# Altium project ESP_Grow_Main_V2.PrjPCB (part 2 of 2)

## Sheet ESP_Grow_Main_V2_4_3V_5V.SchDoc: Power Rails
size A; Date: 5/4/2019; Author: Kyle R; Revision: A; SheetNumber: 4; SheetTotal: 5
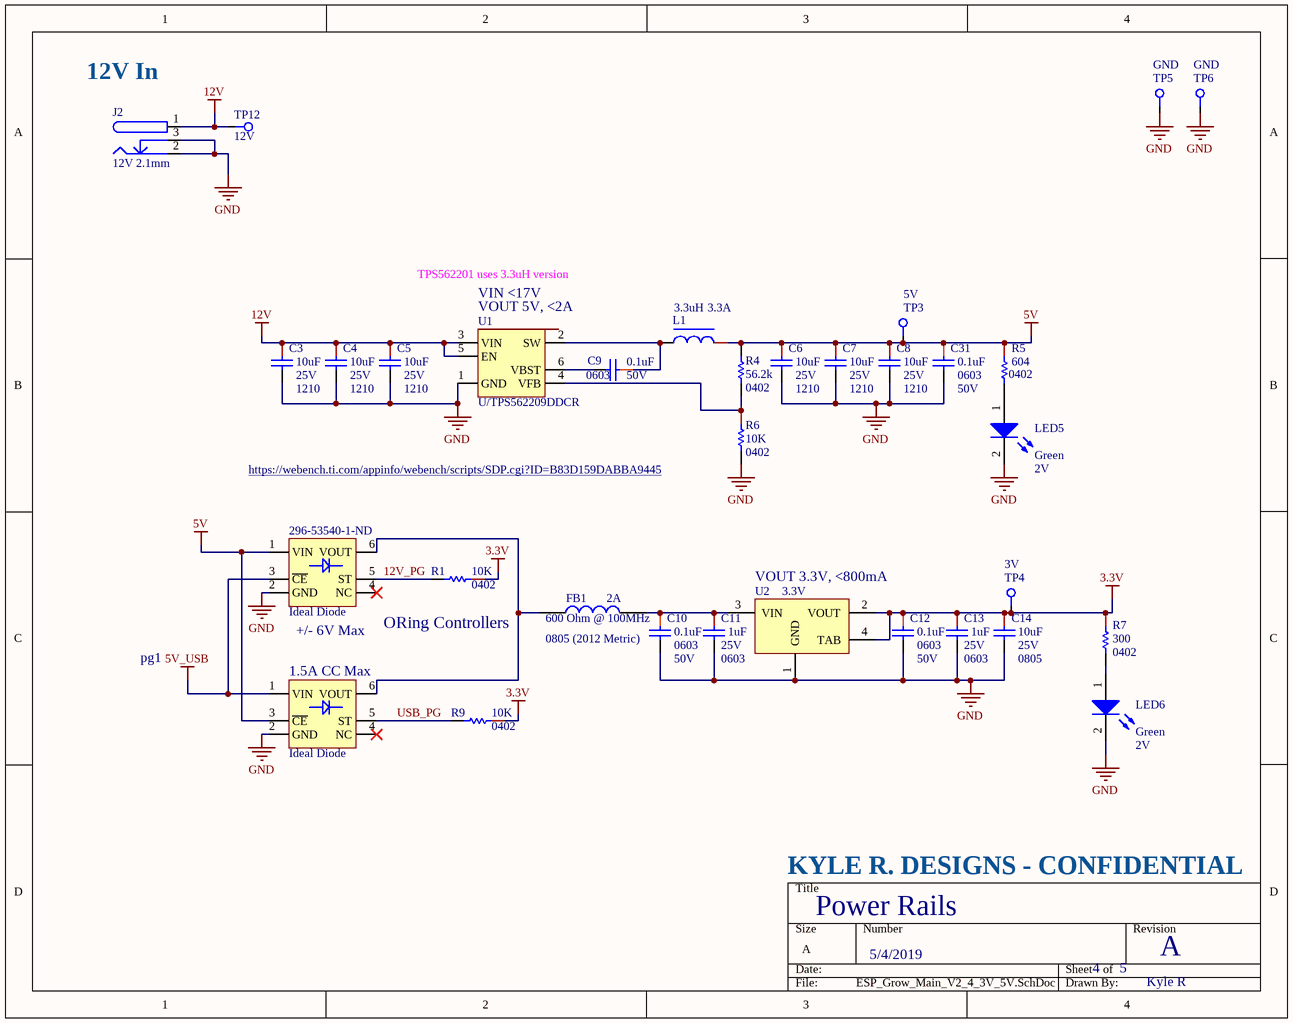
[diagram p4: ESP_Grow_Main_V2_4_3V_5V.SchDoc]

### Parts
C3  10uF  Package / Case: 1210  Voltage Rated: 25V  [CAPC1210(3225)_N]
C4  10uF  Package / Case: 1210  Voltage Rated: 25V  [CAPC1210(3225)_N]
C5  10uF  Package / Case: 1210  Voltage Rated: 25V  [CAPC1210(3225)_N]
C6  10uF  Package / Case: 1210  Voltage Rated: 25V  [CAPC1210(3225)_N]
C7  10uF  Package / Case: 1210  Voltage Rated: 25V  [CAPC1210(3225)_N]
C8  10uF  Package / Case: 1210  Voltage Rated: 25V  [CAPC1210(3225)_N]
C9  Package / Case: 0603  Voltage - Rated: 50V  [CAPC0603(1608)_L]  (hidden comment: 0.1uF)
C10  Package / Case: 0603  Voltage - Rated: 50V  [CAPC0603(1608)_L]  (hidden comment: 0.1uF)
C11  1uF  Voltage - Rated: 25V  Package / Case: 0603  [CAPC0603(1608)_N]
C12  Package / Case: 0603  Voltage - Rated: 50V  [CAPC0603(1608)_L]  (hidden comment: 0.1uF)
C13  1uF  Voltage - Rated: 25V  Package / Case: 0603  [CAPC0603(1608)_N]
C14  10uF  Voltage - Rated: 25V  Package / Case: 0805  [CAPC0805(2012)_L]
C31  Package / Case: 0603  Voltage - Rated: 50V  [CAPC0603(1608)_L]  (hidden comment: 0.1uF)
FB1  600 Ohm @ 100MHz  Current Rating: 2A  Package / Case: 0805 (2012 Metric)  [RESC0805(2012)_N]
J2  12V 2.1mm  [CONN_PWR_JACK_2.1x5.5mm]
L1  Max Current: 3.3A  [MWSA0402S-3R3MT]  (hidden comment: 3.3uH ±20% 3.3A 87mΩ)
LED5  Color: Green  Voltage - Forward (Vf) (Typ): 2V  [SM-LED-0603]  (hidden comment: 5V)
LED6  Color: Green  Voltage - Forward (Vf) (Typ): 2V  [SM-LED-0603]  (hidden comment: 3.3V)
R1  Resistance: 10K  Package: 0402  [RESC0402(1005)_N]  (hidden comment: 0402WGF1002TCE)
R4  Resistance (Ohms): 56.2k  Package / Case: 0402  [RESC0402(1005)_N]  (hidden comment: 56.2K 1%)
R5  Package (Imperial): 0402  [RESC0402(1005)_M]  (hidden comment: 604)
R6  Resistance: 10K  Package: 0402  [RESC0402(1005)_N]  (hidden comment: 0402WGF1002TCE)
R7  Package (Imperial): 0402  Resistance: 300  [RESC0402(1005)_L]  (hidden comment: RES SMD 300 OHM 1% 1/10W 0402)
R9  Resistance: 10K  Package: 0402  [RESC0402(1005)_N]  (hidden comment: 0402WGF1002TCE)
TP3  5V  [Pogo-Testpoint]  (no BOM)
TP4  3V  [Pogo-Testpoint]  (no BOM)
TP5  GND  [Pogo-Testpoint]  (no BOM)
TP6  GND  [Pogo-Testpoint]  (no BOM)
TP12  12V  [Pogo-Testpoint]  (no BOM)
U1  U/TPS562209DDCR  [SOT-23]
U2  3.3V  [DSO-G3]
U14  Ideal Diode  Supplier Part Number 1: 296-53540-1-ND  [SC-70-6]
U15  Ideal Diode  [SC-70-6]

### Nets
3.3V: C12.1 C13.1 C14.1 R1.1 R7.1 R9.1 TP4.1 U2.2(VOUT) U2.4(TAB)
5V: C6.1 C7.1 C8.1 C31.1 L1.1 R4.2 R5.1 TP3.1 U14.1(VIN) U15.3(~{CE})
5V_USB: U14.3(~{CE}) U15.1(VIN)
12V: C3.1 C4.1 C5.1 J2.1 TP12.1 U1.3(VIN) U1.5(EN)
GND: C3.2 C4.2 C5.2 C6.2 C7.2 C8.2 C10.2 C11.2 C12.2 C13.2 C14.2 C31.2 J2.2 J2.3 LED5.2(K) LED6.2(K) R6.2 TP5.1 TP6.1 U1.1(GND) U2.1(GND) U14.2(GND) U15.2(GND)
12V_PG: R1.2 U14.5(ST)
USB_PG: R9.2 U15.5(ST)
NetC9_1: C9.1 L1.2 U1.2(SW)
NetC9_2: C9.2 U1.6(VBST)
NetC10_1: C10.1 C11.1 FB1.2 U2.3(VIN)
NetFB1_1: FB1.1 U14.6(VOUT) U15.6(VOUT)
NetLED5_1: LED5.1(A) R5.2
NetLED6_1: LED6.1(A) R7.2
NetR4_1: R4.1 R6.1 U1.4(VFB)

Not connected (* = marked no-connect by the designer): U14 4(NC)*; U15 4(NC)*

### Notes on the sheet
- (near J2) 12V In
- TPS562201 uses 3.3uH version
- (near U1) VIN <17V
- (near U1) VOUT 5V, <2A
- (near R6) https://webench.ti.com/appinfo/webench/scripts/SDP.cgi?ID=B83D159DABBA9445
- (near U14) +/- 6V Max
- ORing Controllers
- (near U2) VOUT 3.3V, <800mA
- pg1
- (near U15) 1.5A CC Max
- KYLE R. DESIGNS - CONFIDENTIAL

### Library data of the parts
C3-C8 = CAP CER 10UF 25V JB 1210: 10uF 1210 25V; Manufacturer: TDK Corporation; Manufacturer Part Number: C3225JB1E106K250AA; Tolerance: ±10%; Temperature Coefficient: JB; Notification: Current market demand for these product types have resulted in fluctuating and extending lead times. Lead times may differ.; Supplier 1: Digi-Key; RoHS: RoHS Compliant; Category: Capacitors; Stock 1: 19014; Pricing 1: 1=0.74, 10=0.525, 100=0.3454, 500=0.25588 (USD); Packaging: Cut Tape (CT); Part Status: Active; Operating Temperature: -25°C ~ 85°C; Ratings: -; Applications: General Purpose; Failure Rate: -; Mounting Type: Surface Mount, MLCC; Size / Dimension: 0.126" L x 0.098" W (3.20mm x 2.50mm); Height - Seated (Max): -; Thickness (Max): 0.110" (2.80mm); Lead Spacing: -; Lead Style: -; ComponentLink1URL: https://product.tdk.com/info/en/catalog/datasheets/mlcc_commercial_general_en.pdf; ComponentLink1Description: https://product.tdk.com/info/en/catalog/datasheets/mlcc_commercial_general_en.pdf; Supplier Part Number 1: 445-11850-1-ND; Voltage - Rated: 25V; Features: Low ESL
C9 C10 C12 C31 = 0.1uF_0603: 100NF 50V 0603; Manufacturer: YAGEO; Manufacturer Part Number: CC0603KRX7R9BB104; Tolerance: ±10%; Temperature Coefficient: X7R; Supplier 1: Digi-Key; RoHS: RoHS Compliant; Category: Capacitors; Stock 1: 2360000; Pricing 1: 4000=0.00414, 8000=0.00378, 12000=0.0036, 28000=0.00342, 100000=0.00248 (USD); Packaging: Tape & Reel (TR); Mounting Type: Surface Mount, MLCC; Operating Temperature: -55°C ~ 125°C; Applications: General Purpose; Ratings: -; Size / Dimension: 0.063" L x 0.031" W (1.60mm x 0.80mm); Height - Seated (Max): -; Thickness (Max): 0.034" (0.87mm); Lead Spacing: -; Features: -; Lead Style: -; ComponentLink1URL: http://www.kemet.com/datasheets&C0603C104K4RACTU; ComponentLink1Description: http://www.kemet.com/datasheets&C0603C104K4RACTU; Supplier Part Number 1: 399-1096-2-ND; ComponentLink2Description: New link; ComponentLink2URL: *; LCSC Part #: C14663; Capacitance: 0.1uF
C11 C13 = CAP CER 1UF 25V 10% X7R 0603: 1uF 0603 25V; Manufacturer: TDK Corporation; Manufacturer Part Number: CGA3E1X7R1E105K080AC; Tolerance: ±10%; Temperature Coefficient: X7R; Supplier 1: Digi-Key; RoHS: RoHS Compliant; Category: Capacitors; Stock 1: 360610; Pricing 1: 1=0.2, 10=0.135, 100=0.0686, 500=0.04696, 1000=0.04154 (USD); Packaging: Cut Tape (CT); Part Status: Active; Operating Temperature: -55°C ~ 125°C; Features: -; Ratings: AEC-Q200; Applications: Automotive; Failure Rate: -; Mounting Type: Surface Mount, MLCC; Size / Dimension: 0.063" L x 0.032" W (1.60mm x 0.80mm); Height - Seated (Max): -; Thickness (Max): 0.035" (0.90mm); Lead Spacing: -; Lead Style: -; ComponentLink1URL: https://product.tdk.com/info/en/catalog/datasheets/mlcc_automotive_general_en.pdf; ComponentLink1Description: https://product.tdk.com/info/en/catalog/datasheets/mlcc_automotive_general_en.pdf; Supplier Part Number 1: 445-6931-1-ND
C14 = CAP CER 10UF 25V X6S 0805: 10UF 25V X6R 0805; Manufacturer: Murata Electronics North America; Manufacturer Part Number: GRM21BC81E106ME51L; Tolerance: ±20%; Temperature Coefficient: X6S; Notification: Current market demand for these product types have resulted in fluctuating and extending lead times. Lead times may differ.; Supplier 1: Digi-Key; RoHS: RoHS Compliant; Category: Capacitors; Stock 1: 23735; Pricing 1: 1=0.29, 10=0.199, 100=0.1009, 500=0.06906, 1000=0.0611 (USD); Packaging: Cut Tape (CT); Part Status: Active; Operating Temperature: -55°C ~ 105°C; Features: -; Ratings: -; Applications: General Purpose; Mounting Type: Surface Mount, MLCC; Size / Dimension: 0.079" L x 0.049" W (2.00mm x 1.25mm); Height - Seated (Max): -; Thickness (Max): 0.055" (1.40mm); Lead Spacing: -; Lead Style: -; ComponentLink1URL: http://search.murata.co.jp/Ceramy/image/img/A01X/G101/ENG/GRM21BC81E106ME51-01.pdf; ComponentLink1Description: http://search.murata.co.jp/Ceramy/image/img/A01X/G101/ENG/GRM21BC81E106ME51-01.pdf; Supplier Part Number 1: 490-10503-1-ND
FB1 = FERRITE 600 OHM 2.0A 0805: 600 OHM 0805 2.0A; Manufacturer: Wurth Electronics Inc; Manufacturer Part Number: 742792040; DC Resistance (DCR): 150 mOhm Max; Filter Type: Differential Mode - Single; Supplier 1: Digi-Key; RoHS: RoHS Compliant; Category: Filters; Stock 1: 34670; Pricing 1: 1=0.24, 50=0.2344, 100=0.2156, 500=0.20624, 1000=0.19687, 2000=0.1875 (USD); Packaging: Cut Tape (CT); Mounting Type: Surface Mount; Height (Max): 0.043" (1.10mm); Size / Dimension: 0.079" L x 0.047" W (2.00mm x 1.20mm); ComponentLink1URL: http://katalog.we-online.de/pbs/datasheet/742792040.pdf; ComponentLink1Description: http://katalog.we-online.de/pbs/datasheet/742792040.pdf; Supplier Part Number 1: 732-1620-1-ND; ClassName: *; Creator: osman; Impedance @ Frequency: 600 Ohm @ 100MHz
J2 = CONN PWR JACK 2.1: 2.1 mm barrel jack; Manufacturer: CUI Inc; Manufacturer Part Number: PJ-002A; Gender: Male; Plug/Mating Plug Diameter: 2.1mm ID, 5.5mm OD; Number of Positions/Contacts: 2 Conductors, 3 Contacts; Internal Switch(s): Single Switch, Normally Closed; Shielding: Unshielded; Voltage - Rated: 16VDC; Current Rating: 2.5A; Published: 17-Dec-2003; DatasheetDocument: 09-May-2002; Publisher: Altium Limited; ComponentLink1Description: Manufacturer Link; ComponentLink1URL: http://domino.kycon.com/internet/Products.html; RoHS: RoHS Compliant; Category: Connectors, Interconnects; Connector Type: Jack; Mounting Type: Through Hole, Right Angle; Termination: Solder Eyelet(s); Features: -; Color: Black; Contact Material: Copper Alloy; Contact Material - Plating: Tin; Housing Color: Black; Housing Material: Thermoplastic; Operating Temperature: -25°C ~ 85°C; ComponentLink2URL: http://www.cui.com/product/resource/digikeypdf/pj-002a.pdf; ComponentLink2Description: http://www.cui.com/product/resource/digikeypdf/pj-002a.pdf; Supplier 1: Digi-Key; Stock 1: 47553; Pricing 1: 1=1.01, 10=0.704, 100=0.4724, 500=0.3819, 1000=0.3417, 2500=0.27135 (USD); ComponentLink3URL: http://www.cui.com/product/resource/digikeypdf/pj-002ah.pdf; ComponentLink3Description: http://www.cui.com/product/resource/digikeypdf/pj-002ah.pdf; Supplier Part Number 1: CP-002AH-ND
L1 = 3.3uH: 3.3uH ±20% 3.3A 87mΩ SMD,4.2x4.4x2.0mm Power Inductors RoHS; Manufacturer: Sunlord; LCSC Part Number: C408336; Saturation Current: *; ComponentLink1Description: New link; ComponentLink1URL: *; ComponentLink2Description: New link; ComponentLink2URL: *; Package: SMD,4.2x4.4x2.0mm; DC Resistance: 87mΩ; Inductance: 3.3uH; Manufacturer Part Number 1: MWSA0402S-3R3MT
LED5 LED6 = CMP-001-0086-06: LED GREEN CLEAR THIN 0603 SMD; Manufacturer Part Number: LTST-C191KGKT; Manufacturer: Lite-On Inc; Millicandela Rating: 35mcd; Wavelength - Peak: 574nm; Current - Test: 20mA; Wavelength - Dominant: 571nm; Viewing Angle: 130°; Lens Style/Size: Rectangle with Flat Top, 1.1mm x 0.8mm; Size / Dimension: 1.60mm L x 0.80mm W; Mounting Type: Surface Mount; Designator: LTST-C191KGKT; Height: 0.55mm; RoHS: RoHS Compliant; Package / Case: 0603 (1608 Metric); Packaging: Cut Tape (CT); Lens Type: Clear; Pin Count: 2; Stock 1: 84829; Pricing 1: 1=0.3, 10=0.238, 100=0.1296, 250=0.0864, 500=0.07344, 1000=0.05616, 2500=0.05076 (USD); ClassName: *
R1 R6 R9 = 10k_0402: 10KOHMS ±1% 1/10W 0402; Supplier Part Number 1: C25744; Manufacturer Part Number 1: 0402WGF1002TCE; Supplier 1: LCSC
R4 = RES 56.2K OHM 1% 1/10W 0402: 56.2K 1% 0402; Manufacturer: Panasonic Electronic Components; Manufacturer Part Number: ERJ-2RKF5622X; Power (Watts): 0.1W, 1/10W; Temperature Coefficient: ±100ppm/°C; Supplier 1: Digi-Key; RoHS: RoHS Compliant; Category: Resistors; Stock 1: 222789; Pricing 1: 1=0.1, 50=0.0124, 100=0.0091, 250=0.00692, 500=0.00554, 1000=0.00408, 5000=0.00293 (USD); Packaging: Cut Tape (CT); Part Status: Active; Tolerance: ±1%; Composition: Thick Film; Features: Automotive AEC-Q200; Operating Temperature: -55°C ~ 155°C; Supplier Device Package: 0402; Size / Dimension: 0.039" L x 0.020" W (1.00mm x 0.50mm); Height: 0.016" (0.40mm); Number of Terminations: 2; Failure Rate: -; ComponentLink1URL: http://industrial.panasonic.com/www-cgi/jvcr13pz.cgi?E+PZ+3+AOA0002+ERJ2RKF5622X+7+WW; ComponentLink1Description: http://industrial.panasonic.com/www-cgi/jvcr13pz.cgi?E+PZ+3+AOA0002+ERJ2RKF5622X+7+WW; Supplier Part Number 1: P56.2KLCT-ND
R5 = CMP-007-0549-12: RES 604 OHM 1% 1/10W 0402; Package (Metric): 1005; Temperature Coefficient: ±25ppm/°C; Power: 63mW; Resistance: 604; Termination: SMD/SMT; Tolerance: 1%; Operating Temperature: -55°C ~ 155°C; Length: 1mm; Height: 400µm
R7 = CMP-001-0786-04: 300 Ohms ±1% 0.1W, 1/10W Chip Resistor 0402 (1005 Metric) Automotive AEC-Q200 Thick Film; Temperature Coefficient: 100ppm/°C; Voltage Rating (DC): 50V; Max Power Dissipation: 100mW; Package (Metric): 1005; REACH SVHC: No SVHC; Mount: Surface Mount; Min Operating Temperature: -55°C; Contact Plating: Tin; Tolerance: 1%; Max Operating Temperature: 155°C; Lead Free: Lead Free; Width: 200µm; Length: 1mm; Height: 350µm; Number of Terminations: 2; Voltage Rating: 50V; Packaging: Tape and Reel; Military Standard: Not; Power: 100mW; Package Quantity: 10000; Termination: SMD/SMT; Power Rating: 100mW; Composition: Thick Film; Depth: 0.5mm
TP3-TP6 TP12 = CMP-001-0557-03: Test Point- Current one; Pin Count: 1; Component Name: TestPoint; Designator: TestPoint
U1 = U/TPS562209DDCR: IC REG BUCK ADJ 2A TSOT23-6; Voltage - Input (Min): 4.5V; Voltage - Input (Max): 17V; Voltage - Output (Min/Fixed): 0.765V; Voltage - Output (Max): 7V; Frequency - Switching: 650KHZ; Manufacturer Part Number: TPS562209DDCR; Topology: Buck; Current - Output: 2A; Supplier Device Package: TSOT-23-6
U2 = LD1117S33: 3.3 volt fixed regulator, 800mA; Supplier 1: Digi-Key; Supplier Part Number 1: 497-1242-1-ND
U14 U15 = LM66100DCKT: OR Controller P-Channel 1.5A CC; FET Type: P-Type; Voltage - Supply: 1.5V ~ 5.5V; Current - Output (Max): 1.5A; Supplier 1: Digi-Key
  U15: Supplier Part Number 1: 296-53540-1-ND

## Nets that join several sheets
3.3V: ESP_Grow_Main_V2_1_CPU (12 pins), ESP_Grow_Main_V2_2_Pump_NeoPixel (5 pins), ESP_Grow_Main_V2_3_Con (15 pins), ESP_Grow_Main_V2_4_3V_5V (9 pins)
5V: ESP_Grow_Main_V2_2_Pump_NeoPixel (11 pins), ESP_Grow_Main_V2_3_Con (C39.1 CN3.1 R26.1), ESP_Grow_Main_V2_4_3V_5V (10 pins)
5V_USB: ESP_Grow_Main_V2_1_CPU (CN2.1), ESP_Grow_Main_V2_4_3V_5V (U14.3 U15.1)
12V: ESP_Grow_Main_V2_2_Pump_NeoPixel (5 pins), ESP_Grow_Main_V2_4_3V_5V (7 pins)
GND: ESP_Grow_Main_V2_1_CPU (20 pins), ESP_Grow_Main_V2_2_Pump_NeoPixel (28 pins), ESP_Grow_Main_V2_3_Con (19 pins), ESP_Grow_Main_V2_4_3V_5V (23 pins)
12V_PG: ESP_Grow_Main_V2_1_CPU (U17.28), ESP_Grow_Main_V2_4_3V_5V (R1.2 U14.5)
BTN_OLED: ESP_Grow_Main_V2_1_CPU (U17.8), ESP_Grow_Main_V2_3_Con (C43.1 R29.2 SW5.1 SW5.2)
DHT22: ESP_Grow_Main_V2_1_CPU (U17.12), ESP_Grow_Main_V2_3_Con (D7.3 R39.2)
ECHO: ESP_Grow_Main_V2_1_CPU (U17.29), ESP_Grow_Main_V2_3_Con (D6.3 R27.2 R28.1)
MISO: ESP_Grow_Main_V2_1_CPU (R34.1 TP10.1 U17.14), ESP_Grow_Main_V2_3_Con (U8.5)
MOSI: ESP_Grow_Main_V2_1_CPU (TP9.1 U17.16), ESP_Grow_Main_V2_3_Con (U8.3)
NeoPixel_3V: ESP_Grow_Main_V2_1_CPU (U17.30), ESP_Grow_Main_V2_2_Pump_NeoPixel (Q1.2 R2.2)
OLED_SCL: ESP_Grow_Main_V2_1_CPU (TP7.1 U17.36), ESP_Grow_Main_V2_3_Con (J1.3 R31.2)
OLED_SDA: ESP_Grow_Main_V2_1_CPU (TP8.1 U17.33), ESP_Grow_Main_V2_3_Con (J1.4 R32.2)
Pres_CS: ESP_Grow_Main_V2_1_CPU (U17.11), ESP_Grow_Main_V2_3_Con (U8.2)
PUMP_CTRL: ESP_Grow_Main_V2_1_CPU (U17.10), ESP_Grow_Main_V2_2_Pump_NeoPixel (R11.1 SW1.3 SW1.4 U13.6)
PUMP_IMON: ESP_Grow_Main_V2_1_CPU (U17.7), ESP_Grow_Main_V2_2_Pump_NeoPixel (C28.1 R12.2 TP2.1)
PUMP_PG: ESP_Grow_Main_V2_1_CPU (U17.27), ESP_Grow_Main_V2_2_Pump_NeoPixel (R10.2 U13.13)
SCK: ESP_Grow_Main_V2_1_CPU (R24.2 TP11.1), ESP_Grow_Main_V2_3_Con (U8.4)
SOIL_SEN: ESP_Grow_Main_V2_1_CPU (U17.6), ESP_Grow_Main_V2_3_Con (D5.3 R38.2)
TRIG: ESP_Grow_Main_V2_1_CPU (U17.9), ESP_Grow_Main_V2_3_Con (Q4.2 R25.2)
USB_PG: ESP_Grow_Main_V2_1_CPU (U17.31), ESP_Grow_Main_V2_4_3V_5V (R9.2 U15.5)